# EAGLE schematic Buck_Converter_Reference_Board_5V_3A_LM2596S (EAGLE 9.2.2)
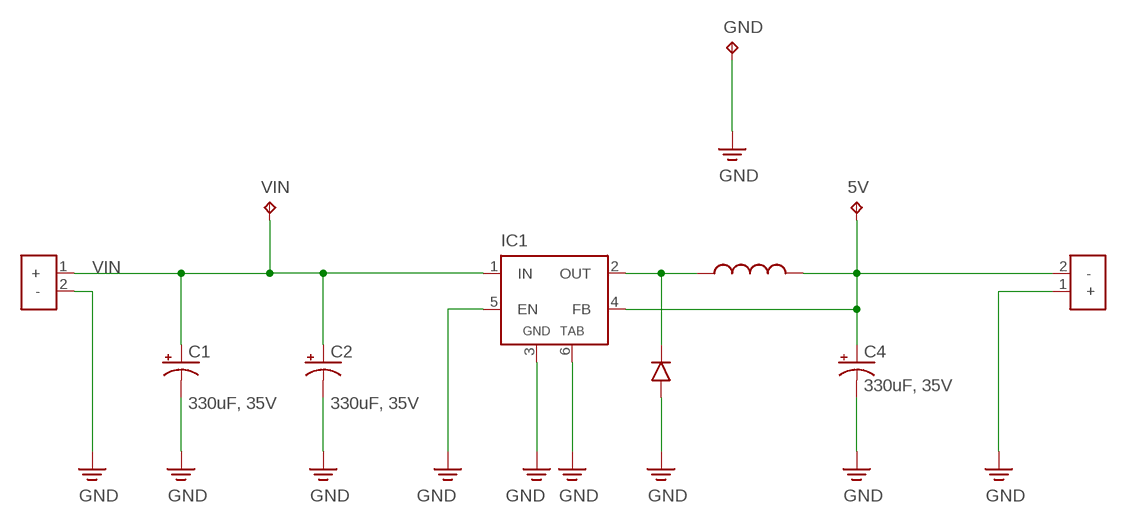
[diagram p0: schematic, sheet 1]

## Parts
5V  TPPAD1-13  [P1-13]
C1  330uF, 35V  _CAPACITOR_POL_A_HA0  [_CAPACITOR_CHEMI-CON_A_HA0_SMD]
C2  330uF, 35V  _CAPACITOR_POL_A_HA0  [_CAPACITOR_CHEMI-CON_A_HA0_SMD]
C4  330uF, 35V  _CAPACITOR_POL_A_HA0  [_CAPACITOR_CHEMI-CON_A_HA0_SMD]
GND  TPPAD1-13  [P1-13]
IC1  _VOLTAG_REGULATOR_LM2596S  [_PACKAGE_TO263-5]
U$1  POWER_CONNECTOR  [_TERMINAL_BLOCK_2.54_1X2]
U$22  POWER_CONNECTOR  [_TERMINAL_BLOCK_2.54_1X2]
U$23  _INDUCTOR_PE-54040SNL  [_PACKAGE_HCI-68]
U$24  _DIODE_SOD128  [_PACKAGE_SOD128]
VIN  TPPAD1-13  [P1-13]

## Nets
5V: 5V.TP C4.+ IC1.4(FB) U$1.2(-) U$23.2
GND: C1.- C2.- C4.- GND.TP IC1.3(GND) IC1.5(EN) IC1.6(TAB) U$1.1(+) U$22.2(-) U$24.A(+)
N$11: IC1.2(OUT) U$23.1 U$24.C(-)
VIN: C1.+ C2.+ IC1.1(IN) U$22.1(+) VIN.TP

## Library data of the parts
5V GND VIN = testpad:TP: Test pad
C1 C2 C4 = Z:_CAPACITOR_POL
IC1 = Z:_VOLTAG_REGULATOR: STEP-DOWN VOLTAGE REGULATOR
U$1 U$22 = Z:POWER_CONNECTOR
U$23 = Z:_INDUCTOR
U$24 = Z:_DIODE